# EAGLE design IOTBeev0.1 (EAGLE 6.6.0)
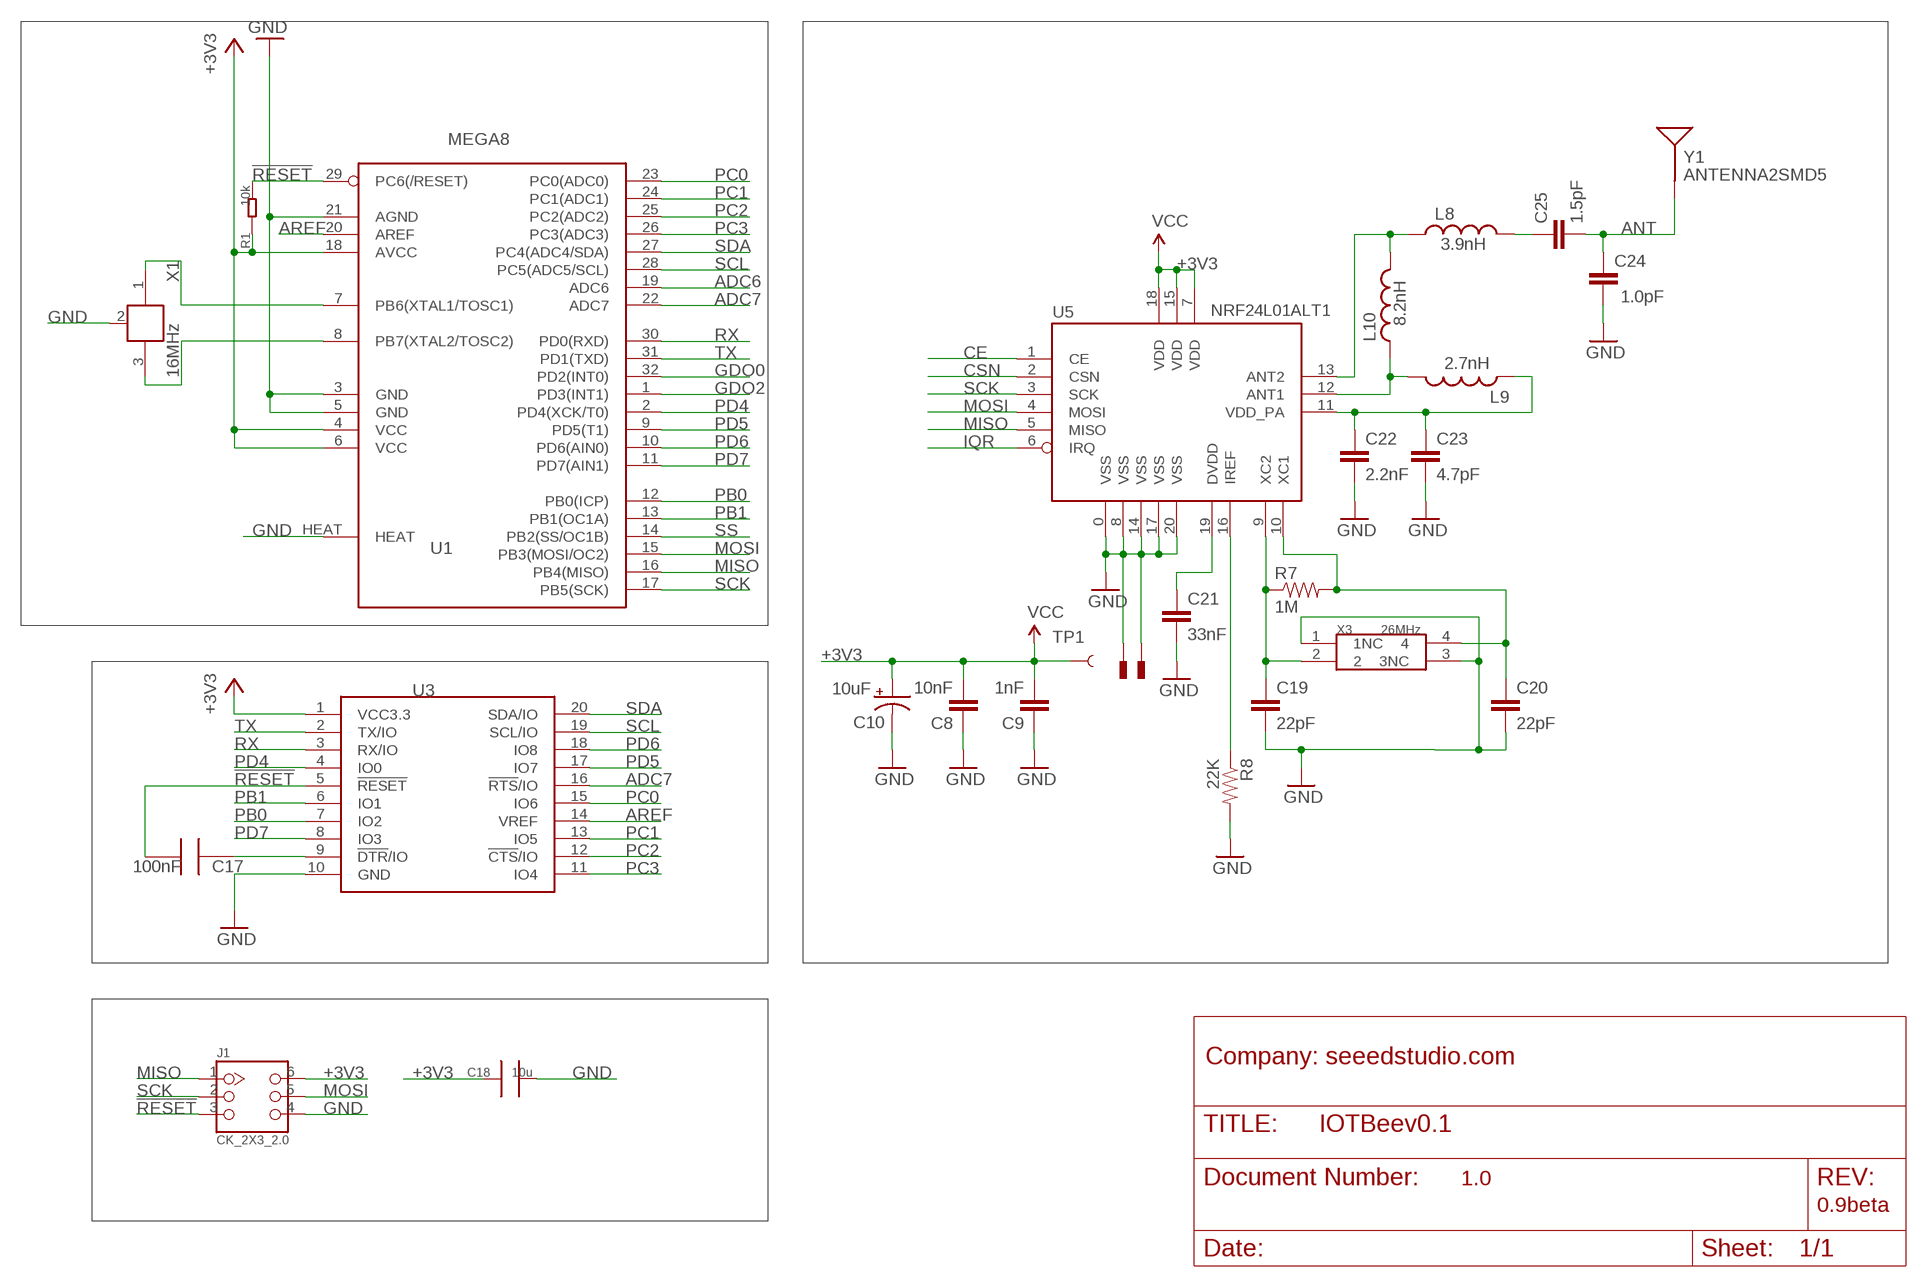
[diagram p0: schematic, sheet 1]

## Parts
C8  10nF  CAP0402-CAP  [0402-CAP]
C9  1nF  CAP0402-CAP  [0402-CAP]
C10  10uF  CAP_POL3528  [EIA3528]
C17  100nF  C0603_S  [0603_S]
C18  10u  C0805  [0805]
C19  22pF  CAP0402-CAP  [0402-CAP]
C20  22pF  CAP0402-CAP  [0402-CAP]
C21  33nF  CAP0402-CAP  [0402-CAP]
C22  2.2nF  CAP0402-CAP  [0402-CAP]
C23  4.7pF  CAP0402-CAP  [0402-CAP]
C24  1.0pF  CAP0402-CAP  [0402-CAP]
C25  1.5pF  CAP0402-CAP  [0402-CAP]
J1  CK_2X3_2.0  [CK_2X3_2.0]
L8  3.9nH  INDUCTOR0402  [C0402]
L9  2.7nH  INDUCTOR0402  [C0402]
L10  8.2nH  INDUCTOR0402  [C0402]
R1  10k  R0603_S  [0603_S]
R7  1M  RESISTOR0402-RES  [0402-RES]
R8  22K  RESISTOR0402-RES  [0402-RES]
TP1  TEST-POINT3X5  [PAD.03X.05]
U1  MEGA8  [MLF32X]
U3  BEE-OPENBEE-BTSMD  [20P-SMD-2.0-BT]
U5  NRF24L01ALT1  [QFN20_ALT1]
U$2  PAD  [PAD-0.008]
U$4  PAD  [PAD-0.008]
X1  16MHz  XTAL_NCVER  [XTAL_3X2]
X3  26MHz  XTAL_SMD_3225  [X3225]
Y1  ANTENNA2SMD5  [ANTENNA-CHIP5]

## Nets
!RESET: C17.2 J1.3 R1.2 U1.29(PC6(/RESET)) U3.5(!RESET)
+3V3: C8.2 C9.2 C10.A(+) C18.1 J1.6 R1.1 TP1.P$1 U1.4(VCC) U1.6(VCC) U1.18(AVCC) U3.1(VCC3.3) U5.7(VDD) U5.15(VDD) U5.18(VDD) ; supply symbol labelled VCC
ADC6: U1.19(ADC6)
ADC7: U1.22(ADC7) U3.16(!RTS!/IO)
ANT: C24.2 C25.2 Y1.FEED(SIGNAL)
AREF: U1.20(AREF) U3.14(VREF)
CE: U5.1(CE)
CSN: U5.2(CSN)
DTR: C17.1 U3.9(!DTR!/IO)
GDO0: U1.32(PD2(INT0))
GDO2: U1.1(PD3(INT1))
GND: C8.1 C9.1 C10.C(-) C18.2 C19.2 C20.2 C21.2 C22.2 C23.2 C24.1 J1.4 R8.2 U1.3(GND) U1.5(GND) U1.21(AGND) U1.HEAT U3.10(GND) U5.0(VSS) U5.8(VSS) U5.14(VSS) U5.17(VSS) U5.20(VSS) U$2.P$1 U$4.P$1 X1.2(GND) X3.1(1NC) X3.3(3NC)
IQR: U5.6(IRQ)
MISO: J1.1 U1.16(PB4(MISO)) U5.5(MISO)
MOSI: J1.5 U1.15(PB3(MOSI/OC2)) U5.4(MOSI)
N$11: U1.7(PB6(XTAL1/TOSC1)) X1.1
N$13: U1.8(PB7(XTAL2/TOSC2)) X1.3
N$19: C19.1 R7.1 U5.9(XC2) X3.2
N$20: C20.1 R7.2 U5.10(XC1) X3.4
N$22: L8.1 L10.2 U5.13(ANT2)
N$23: C22.1 C23.1 L9.1 U5.11(VDD_PA)
N$24: R8.1 U5.16(IREF)
N$25: C21.1 U5.19(DVDD)
N$26: L9.2 L10.1 U5.12(ANT1)
N$27: C25.1 L8.2
PB0: U1.12(PB0(ICP)) U3.7(IO2)
PB1: U1.13(PB1(OC1A)) U3.6(IO1)
PC0: U1.23(PC0(ADC0)) U3.15(IO6)
PC1: U1.24(PC1(ADC1)) U3.13(IO5)
PC2: U1.25(PC2(ADC2)) U3.12(!CTS!/IO)
PC3: U1.26(PC3(ADC3)) U3.11(IO4)
PD4: U1.2(PD4(XCK/T0)) U3.4(IO0)
PD5: U1.9(PD5(T1)) U3.17(IO7)
PD6: U1.10(PD6(AIN0)) U3.18(IO8)
PD7: U1.11(PD7(AIN1)) U3.8(IO3)
RX: U1.30(PD0(RXD)) U3.3(RX/IO)
SCK: J1.2 U1.17(PB5(SCK)) U5.3(SCK)
SCL: U1.28(PC5(ADC5/SCL)) U3.19(SCL/IO)
SDA: U1.27(PC4(ADC4/SDA)) U3.20(SDA/IO)
SS: U1.14(PB2(SS/OC1B))
TX: U1.31(PD1(TXD)) U3.2(TX/IO)

## Notes on the sheet
- Company: seeedstudio.com
- 1.0
- 0.9beta

## Library data of the parts
C8 C9 C19-C25 = SparkFun:CAP: Capacitor Standard 0603 ceramic capacitor, and 0.1" leaded capacitor.
C10 = SparkFun:CAP_POL: Capacitor Polarized These are standard SMD and PTH capacitors. Normally 10uF, 47uF, and 100uF in electrolytic and tantalum varieties. Always verify the external diameter of the through hole cap, it varies with capacity, voltage, and manufacturer. The EIA devices should be standard.
C17 = CPT_SMD:C0603
C18 = CPT_SMD:C0805
J1 = CONNECTER:CK_2X3
L8-L10 = SparkFun:INDUCTOR: Inductors Basic Inductor/Choke - 0603 and 1206. Footprints are not proven and vary greatly between part numbers.
R1 = CPT_SMD:R0603
R7 R8 = SparkFun:RESISTOR: Resistor Basic schematic elements and footprints for 0603, 1206, and PTH resistors.
TP1 = SparkFun:TEST-POINT
U1 = ICs_v54:MEGA8
U3 = Duinopeak-Module:BEE-OPENBEE
U5 = Testing:NRF24L01: 2.4GHz Low Power Transceiver This is the very popular, low cost, very low power RF transceiver from Nordic Semiconductor. Simple SPI interface. SKU: COM-00690
U$2 U$4 = Testing:PAD
X1 = CPT_SMD:XTAL_NC
X3 = CPT_SMD:XTAL_SMD
Y1 = SparkFun:ANTENNA2: Antenna Single endded antenna. Common with smaller chip antennas. CHIP4 package is the GPS Chip Antenna SKU: GPS-08418. CHIP5 package is 2.4GHz chip antenna SKU: WRL-00144.

## Board
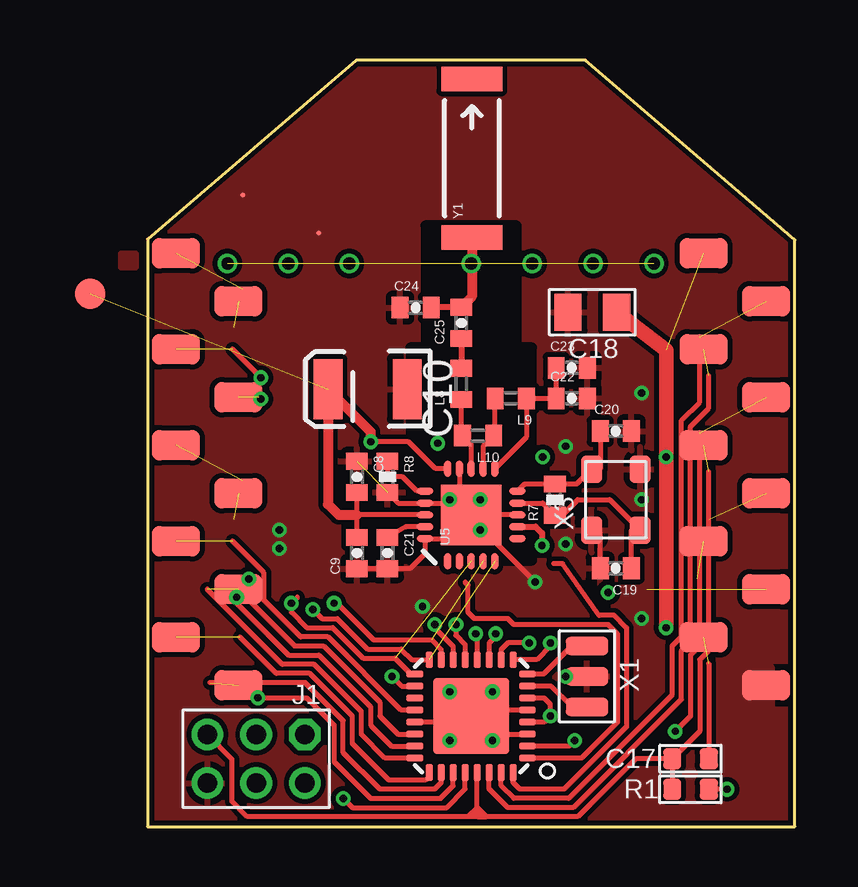
[diagram p1: board, top side]
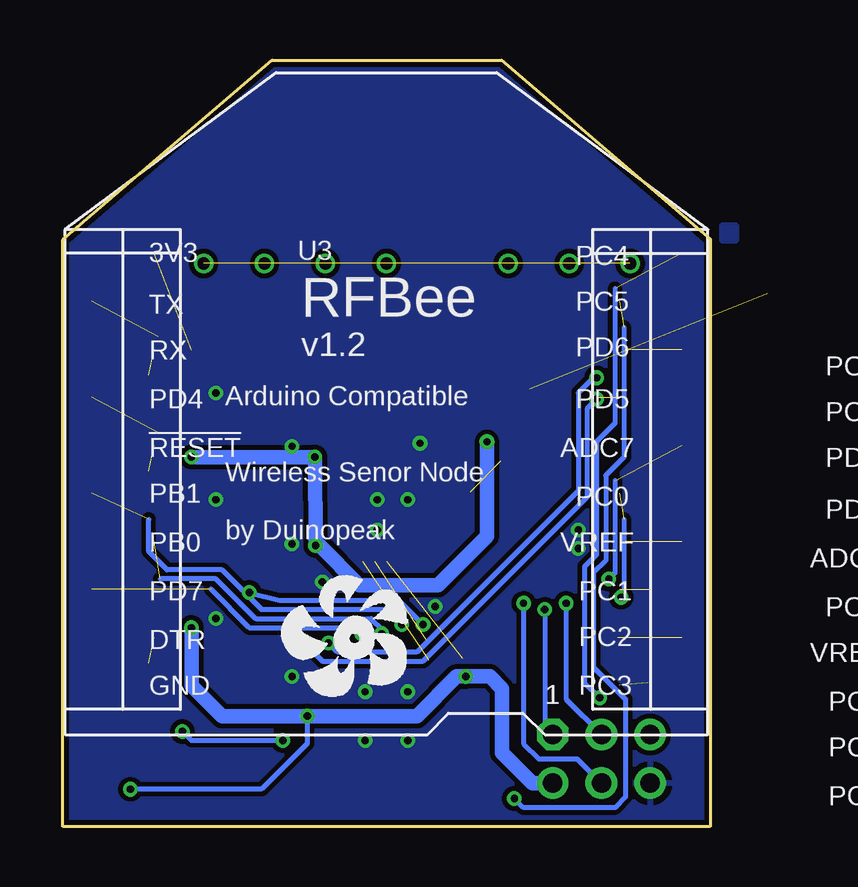
[diagram p2: board, bottom side, seen from below]

Size 26.99 x 31.94 mm. Coordinates in mm from the lower left corner, seen from the top.
Outline: 8.7,31.94 0,24.48 0,0 26.99,0 26.99,24.45 18.26,31.94 8.7,31.94
Copper layers (1*16): Top 0.035mm / dielectric 1.5mm / Bottom 0.035mm
Design rules "SeeedStudio_rule_no_angle_090911 *": minimum track width 6mil, minimum drill 12mil, track to track 6mil, track to pad 6mil, pad to pad 6mil, via to via 6mil, smd to smd 0mil, copper to edge 3mil, drill to drill 10mil, minimum pad ring 10mil, minimum via ring 6mil, stop-mask expansion 2mil, vias tented up to drill 30mil, thermal gap 10mil
tRestrict: area 10.7,1.8 to 16.3,7.4; area 11,11.1 to 16,20; area 11.6,20 to 15.4,25.1

### Footprints (pad centres in the part's own frame; a part is rotated, then mirrored left to right if it is on the bottom)
0402-CAP = smd 0.7 x 0.9: 1 -0.65,0; 2 0.65,0
EIA3528 = smd 1.2 x 2.5: A 1.65,0; C -1.65,0
0603_S = smd 0.762 x 0.889: 1 -0.762,0; 2 0.762,0
0805 = smd 1.143 x 1.524: 1 -1.016,0; 2 1.016,0
CK_2X3_2.0 = drill 0.813 pad 1.27 octagon: 1 -1.016,2.032 | drill 0.813 pad 1.27: 2 -1.016,0; 3 -1.016,-2.032; 4 1.016,-2.032; 5 1.016,0; 6 1.016,2.032
C0402 = smd 0.7 x 0.9: 1 -0.65,0; 2 0.65,0
0402-RES = smd 0.7 x 0.9: 1 -0.65,0; 2 0.65,0
PAD.03X.05 = smd 1.27 x 1.27: P$1 0,0
MLF32X = smd 0.7 x 0.3: 1 -2.35,1.75; 2 -2.35,1.25; 3 -2.35,0.75; 4 -2.35,0.25; 5 -2.35,-0.25; 6 -2.35,-0.75; 7 -2.35,-1.25; 8 -2.35,-1.75; 17 2.35,-1.75; 18 2.35,-1.25; 19 2.35,-0.75; 20 2.35,-0.25; 21 2.35,0.25; 22 2.35,0.75; 23 2.35,1.25; 24 2.35,1.75 | smd 0.3 x 0.7: 9 -1.75,-2.35; 10 -1.25,-2.35; 11 -0.75,-2.35; 12 -0.25,-2.35; 13 0.25,-2.35; 14 0.75,-2.35; 15 1.25,-2.35; 16 1.75,-2.35; 25 1.75,2.35; 26 1.25,2.35; 27 0.75,2.35; 28 0.25,2.35; 29 -0.25,2.35; 30 -0.75,2.35; 31 -1.25,2.35; 32 -1.75,2.35 | smd 3.175 x 3.175: HEAT 0,0
20P-SMD-2.0-BT = smd 2 x 1.27 bottom: 1 -9.7,9; 2 -12.3,7; 3 -9.7,5; 4 -12.3,3; 5 -9.7,1; 6 -12.3,-1; 7 -9.7,-3; 8 -12.3,-5; 9 -9.7,-7; 10 -12.3,-9; 11 9.7,-9; 12 12.3,-7; 13 9.7,-5; 14 12.3,-3; 15 9.7,-1; 16 12.3,1; 17 9.7,3; 18 12.3,5; 19 9.7,7; 20 12.3,9
QFN20_ALT1 = smd 2.515 x 2.515: 0 0,0 | smd 0.686 x 0.293: 1 -1.925,0.986; 2 -1.925,0.493; 3 -1.925,0; 4 -1.925,-0.493; 5 -1.925,-0.986; 11 1.925,-0.986; 12 1.925,-0.493; 13 1.925,0; 14 1.925,0.493; 15 1.925,0.986 | smd 0.293 x 0.686: 6 -0.986,-1.925; 7 -0.493,-1.925; 8 0,-1.925; 9 0.493,-1.925; 10 0.986,-1.925; 16 0.986,1.925; 17 0.493,1.925; 18 0,1.925; 19 -0.493,1.925; 20 -0.986,1.925
PAD-0.008 = smd 0.203 x 0.203: P$1 0,0
XTAL_3X2 = smd 0.762 x 1.778: 1 -1.27,0; 2 0,0; 3 1.27,0
X3225 = smd 1.143 x 0.889: 1 -1.27,1.016; 2 -1.27,-1.016; 3 1.27,-1.016; 4 1.27,1.016
ANTENNA-CHIP5 = smd 1.016 x 2.54: FEED -3.302,0; NC 3.302,0

### Placement (x,y rotation side)
C8  8.73,14.57 270 top
C9  8.73,11.4 90 top
C10  9.18,18.22 180 top
C17  22.64,2.83 180 top
C18  18.54,21.43 180 top
C19  19.53,10.76 180 top
C20  19.53,16.48 0 top
C21  10,11.4 270 top
C22  17.68,17.84 0 top
C23  17.68,19.11 0 top
C24  11.18,21.62 0 top
C25  13.08,20.99 90 top
J1  4.53,2.83 270 top
L8  13.08,18.45 90 top
L9  15.14,17.84 180 top
L10  13.78,16.29 180 top
R1  22.64,1.56 180 top
R7  16.99,13.62 90 top
R8  10,14.57 270 top
TP1  -2.38,22.19 0 top
U1  13.49,4.6 180 top
U3  13.49,14.88 0 bottom
U5  13.49,12.99 90 top
U$1  [DUINOFUN-LOGO-PCB-0.7]  17.94,5.37 0 bottom
U$2  7.14,24.73 0 top
U$4  3.97,26.32 0 top
X1  18.32,6.25 90 top
X3  19.53,13.62 90 top
Y1  13.53,27.84 90 top

### Tracks (layer width: path | path; a pad name or v marks a point on that pad's centre or on a via)
!RESET  (1 unrouted)
  Top 0.203: J1.3 3.52,2.81 3.52,1.05 4.16,0.41 13.75,0.41 | 13.75,0.41 13.74,0.42 | 13.24,0.41 13.37,0.41 13.75,0.79 | 13.75,0.79 13.75,0.67 | 13.75,0.67 13.62,0.54 13.87,0.54 13.75,0.41 | 13.75,0.41 14.13,0.41 | 14.13,0.41 13.75,0.79 | U1.29 13.74,0.67 13.75,0.67 | 14.13,0.41 17.94,0.41 20.35,2.83 C17.2 | 23.4,14.8 23.4,7.33 23.02,6.95 23.02,3.97 C17.2 | C17.2 R1.2
+3V3  (via drill 0.3)  (2 unrouted)
  Top 0.203: U1.4 16.54,4.35 v16.8,4.61 16.8,5.1 16.54,5.35 U1.6 | v24.16,1.56 R1.1 | U1.18 10.59,5.85 v10.19,6.25 | U5.18 8.73,12.99 | 8.73,12.99 C8.2 | C9.2 8.73,12.99 | U5.15 12.01,14.91 10.89,16.03 v9.3,16.03
  Top 0.254: U5.7 16.18,12.49 16.45,12.22 v16.45,11.72
  Top 0.406: v9.3,16.03 9.3,16.45 C10.A 7.53,13.43 7.97,12.99 8.73,12.99
  Top 0.61: C18.1 21.62,19.84 v21.62,15.4 v21.62,8.29
  Bottom 0.203: v24.16,1.56 18.7,1.56 16.8,3.46 v16.8,4.61
  Bottom 0.61: v9.3,16.03 9.3,12.1 11.33,10.06 14.13,10.06 14.64,10.06 16.29,11.72 v16.45,11.72 v16.48,15.4 v21.62,15.4 | J1.6 7.4,1.81 8.67,3.08 8.67,5.75 9.18,6.25 v10.19,6.25 10.57,6.25 12.22,4.6 v16.79,4.6 v16.8,4.61 v16.8,4.6 20.35,4.6 21.62,5.87 v21.62,8.29
  pour Top: -1.11,23.91 -0.48,23.91 -0.48,23.27 -1.11,23.27
ADC7  (via drill 0.3)  (1 unrouted)
  Top 0.203: v4.22,10.32 4.35,10.19 4.35,9.3 6.13,7.52 7.33,7.52 9.68,5.17 9.68,4.6 10.43,3.85 U1.22
  Bottom 0.203: v4.22,10.32 3.97,10.57 3.97,14.42
ANT
  Top 0.254: C25.2 11.84,21.64 C24.2
  Top 0.406: Y1.FEED 13.53,22.08 C25.2
AREF  (1 unrouted)
  Top 0.203: 3.54,11.89 4.86,10.57 4.86,9.43 6.38,7.91 7.52,7.91 10.58,4.85 U1.20
DTR  (1 unrouted)
  Top 0.203: 23.4,6.8 C17.1
GDO0
  Top 0.203: 16.92,10.95 17.3,10.95 18.83,8.79 19.46,8.79 19.97,8.29 19.97,4.16 17.37,1.56 15.53,1.56 15.24,1.84 U1.32
GDO2
  Top 0.203: 13.24,10.19 13.37,10.06 13.37,8.92 13.62,8.67 15.02,8.67 15.27,8.41 19.21,8.41 19.59,8.03 19.59,4.35 18.09,2.85 U1.1
GND  (via drill 0.3)  (1 unrouted)
  Top 0.203: U1.21 13.24,4.35 U1.HEAT | U1.5 13.74,4.85 U1.HEAT | U1.3 14.24,3.85 U1.HEAT | v14.38,3.59 14.38,3.71 U1.HEAT | v14.38,5.62 14.38,5.49 U1.HEAT | v16.16,10.19 14,12.35 v13.87,12.35 13.87,12 U5.20 11.57,11.38 11.27,11.08 10.94,10.75 C21.2 C9.1 | C19.2 18.88,12.35 X3.1 | R8.2 10.45,13.48 U5.17 12.6,13.48 v12.6,13.62 13,14.02 U5.14 | U5.8 13.87,12.99 v13.87,13.62
  Top 0.406: 12.6,13.48 13,13.48 U5.0 | U5.0 13.49,12.73 v13.87,12.35 | 13.87,12.99 U5.0
  other vias: 17.43,11.78 11.46,9.18 17.43,6.25 5.49,12.35 5.49,11.59 12.6,3.59 12.6,5.62 20.61,8.67 17.43,15.84 20.61,13.62 20.61,18.07 12.1,15.97
  pour Bottom: -1.11,25.05 -0.48,25.05 -0.48,24.42 -1.11,24.42
  pour Top (isolate 0.203, rank 6): -0.16,32.04 26.83,32.04 26.83,-0.35 -0.16,-0.35
  pour Bottom (isolate 0.203, rank 6): -0.16,32.04 26.83,32.04 26.83,-0.35 -0.16,-0.35
  pour Top (isolate 0.254, no thermals): 23.02,6.64 25.94,6.64 25.94,4.73 23.02,4.73
  pour Bottom (isolate 0.203, no thermals): 23.02,6.64 25.94,6.64 25.94,4.73 23.02,4.73
GND1  (via drill 0.51)  (6 unrouted)
  other vias: 3.33,23.46 5.87,23.46 8.41,23.46 13.49,23.46 16.03,23.46 18.57,23.46 21.11,23.46
MISO  (via drill 0.3)  (1 unrouted)
  Top 0.203: 7.02,9.18 v6.89,9.05 7.27,8.67 7.91,8.67 9.18,7.4 10.57,7.4 11.02,6.95 U1.16
  Bottom 0.203: J1.1 6.89,4.17 v6.89,9.05
MOSI  (via drill 0.3)  (1 unrouted)
  Top 0.203: U1.15 12.24,7.38 11.84,7.78 9.43,7.78 7.91,9.3 v7.78,9.3
  Bottom 0.203: J1.5 5.54,2.83 7.14,2.83 7.78,3.46 v7.78,9.3
N$11
  Top 0.203: U1.7 16.82,5.85 17.68,4.98 X1.1
N$13
  Top 0.203: U1.8 16.51,6.35 17.68,7.52 X1.3
N$19
  Top 0.203: C19.1 20.18,12.35 X3.2 19.27,13.62 17.94,13.62 17.29,12.97 R7.1 16.48,13.48 U5.9
N$20
  Top 0.203: 18.88,15.26 X3.4 | C20.1 18.88,14.89 X3.4 | X3.4 17.89,14.27 R7.2 15.72,14.27 U5.10
N$22
  Top 0.203: U5.13 13.49,15.92 L10.2 13.08,16.34 L8.1
N$23
  Top 0.203: C23.1 C22.1 L9.1 15.79,16.23 U5.11
N$24
  Top 0.203: U5.16 11.24,13.97 10.64,14.57 10.02,14.57 R8.1
N$25
  Top 0.203: U5.19 10.76,12.49 C21.1
N$26
  Top 0.203: U5.12 13.99,15.84 L10.1 14.49,16.35 L9.2
N$27
  Top 0.254: C25.1 L8.2
PB0  (via drill 0.3)  (1 unrouted)
  Top 0.203: U1.12 13.74,7.97 v13.68,8.03
  Bottom 0.203: v13.68,8.03 13.68,8.22 14.13,8.67 18.95,8.67 20.61,10.32 22.92,10.32
PB1  (via drill 0.3)  (1 unrouted)
  Top 0.203: U1.13 13.24,7.58 12.86,7.97 v12.86,8.41
  Bottom 0.203: v12.86,8.41 13.49,9.05 18.7,9.05 20.35,10.7 22.64,10.7 23.4,11.46 23.4,12.8
PC0  (via drill 0.3)  (1 unrouted)
  Top 0.203: v3.71,9.56 3.71,9.3 5.87,7.14 7.14,7.14 9.3,4.98 9.3,4.22 10.17,3.35 U1.23
  Bottom 0.203: v3.71,9.56 3.59,9.68 3.59,12.8
PC1  (1 unrouted)
  Top 0.203: 2.49,9.89 5.62,6.76 6.95,6.76 8.92,4.79 8.92,3.84 9.91,2.85 U1.24
PC2  (1 unrouted)
  Top 0.203: U1.25 11.74,2.09 11.59,1.94 10.06,1.94 8.54,3.46 8.54,4.6 6.76,6.38 5.37,6.38 3.86,7.89
PC3  (1 unrouted)
  Top 0.203: U1.26 12.24,1.83 11.97,1.56 9.68,1.56 8.16,3.08 8.16,4.41 6.57,6 2.6,6
PD4  (via drill 0.3)  (1 unrouted)
  Top 0.203: U1.2 17.58,3.35 v17.81,3.59 | 23.02,16.42 23.02,7.52 22.64,7.14 22.64,4.6 v22,3.97
  Bottom 0.203: v17.81,3.59 21.62,3.59 v22,3.97
PD5  (via drill 0.3)  (1 unrouted)
  Top 0.203: v4.73,17.81 4.65,17.89 | U1.9 16.22,6.95 16.8,7.52 v16.8,7.65
  Bottom 0.203: v4.73,17.81 5.11,17.43 5.11,13.75 11.97,6.89 16.16,6.89 16.8,7.52 v16.8,7.65
PD6  (via drill 0.3)  (1 unrouted)
  Top 0.203: v4.73,18.7 3.54,19.89 | U1.10 14.74,7.38 15.02,7.65 v15.91,7.65
  Bottom 0.203: v4.73,18.7 4.86,18.7 5.49,18.07 5.49,14 12.22,7.27 15.53,7.27 v15.91,7.65
PD7  (via drill 0.3)  (1 unrouted)
  Top 0.203: U1.11 14.24,7.64 14.51,7.91 v14.51,8.03
  Bottom 0.203: v14.51,8.03 14.76,8.29 19.21,8.29 20.81,9.89
RX  (1 unrouted)
  Top 0.203: U1.30 14.24,1.57 15.02,0.79 17.75,0.79 22.26,5.3 22.26,7.33 22.64,7.71 22.64,16.67 23.4,17.43 23.4,18.8
SCK  (via drill 0.3)  (1 unrouted)
  Top 0.203: 6.25,9.56 v6,9.3 6,8.92 6.64,8.29 7.71,8.29 8.99,7.02 10.32,7.02 10.98,6.35 U1.17
  Bottom 0.203: J1.2 6,5.31 v6,9.3
SCL  (via drill 0.3)  (1 unrouted)
  Top 0.203: U1.28 13.24,1.56 12.48,0.79 8.54,0.79 v8.16,1.17
  Bottom 0.203: 3.59,20.8 3.59,15.4 4.35,14.64 4.35,11.08 4.86,10.57 4.86,6.64 3.52,5.3 3.52,1.24 3.97,0.79 7.78,0.79 v8.16,1.17
SDA  (via drill 0.3)  (1 unrouted)
  Top 0.203: U1.27 12.74,1.69 12.22,1.17 9.3,1.17 7.78,2.7 7.78,4.22 6.64,5.37 v4.6,5.37
  Bottom 0.203: v4.6,5.37 5.24,6 5.24,10.83 4.73,11.33 4.73,16.03 3.97,16.8 3.97,22.42
SS  (via drill 0.3)
  Top 0.203: U1.14 12.74,7.51 11.97,8.29 v11.97,8.41
  Bottom 0.203: v11.97,8.41 12.99,9.43 17.94,9.43 v19.21,9.75
TX  (1 unrouted)
  Top 0.203: U1.31 14.74,1.7 15.27,1.17 17.56,1.17 21.88,5.49 21.88,7.52 22.26,7.91 22.26,16.92 23.02,17.68 23.02,20.42

### Text on the board
bPlace: PC4 | 3V3 | PC5 | RFBee | TX | PD6 | v1.2 | RX | PC4 | PD5 | Arduino Compatible | PD4 | PC5 | ADC7 | !RESET | PD6 | Wireless Senor Node | PB1 | PD5 | PC0 | VREF | by Duinopeak | PB0 | ADC7 | PC1 | PD7 | PC0 | 3V3 | PC2 | DTR | VREF | TX | PC3 | GND | PC1 | 1 | RX | PC2 | PD4 | PC3 | !RESET | PB1 | PB0 | PD7 | DTR | GND